# EAGLE design LED-driver (EAGLE 4.16)
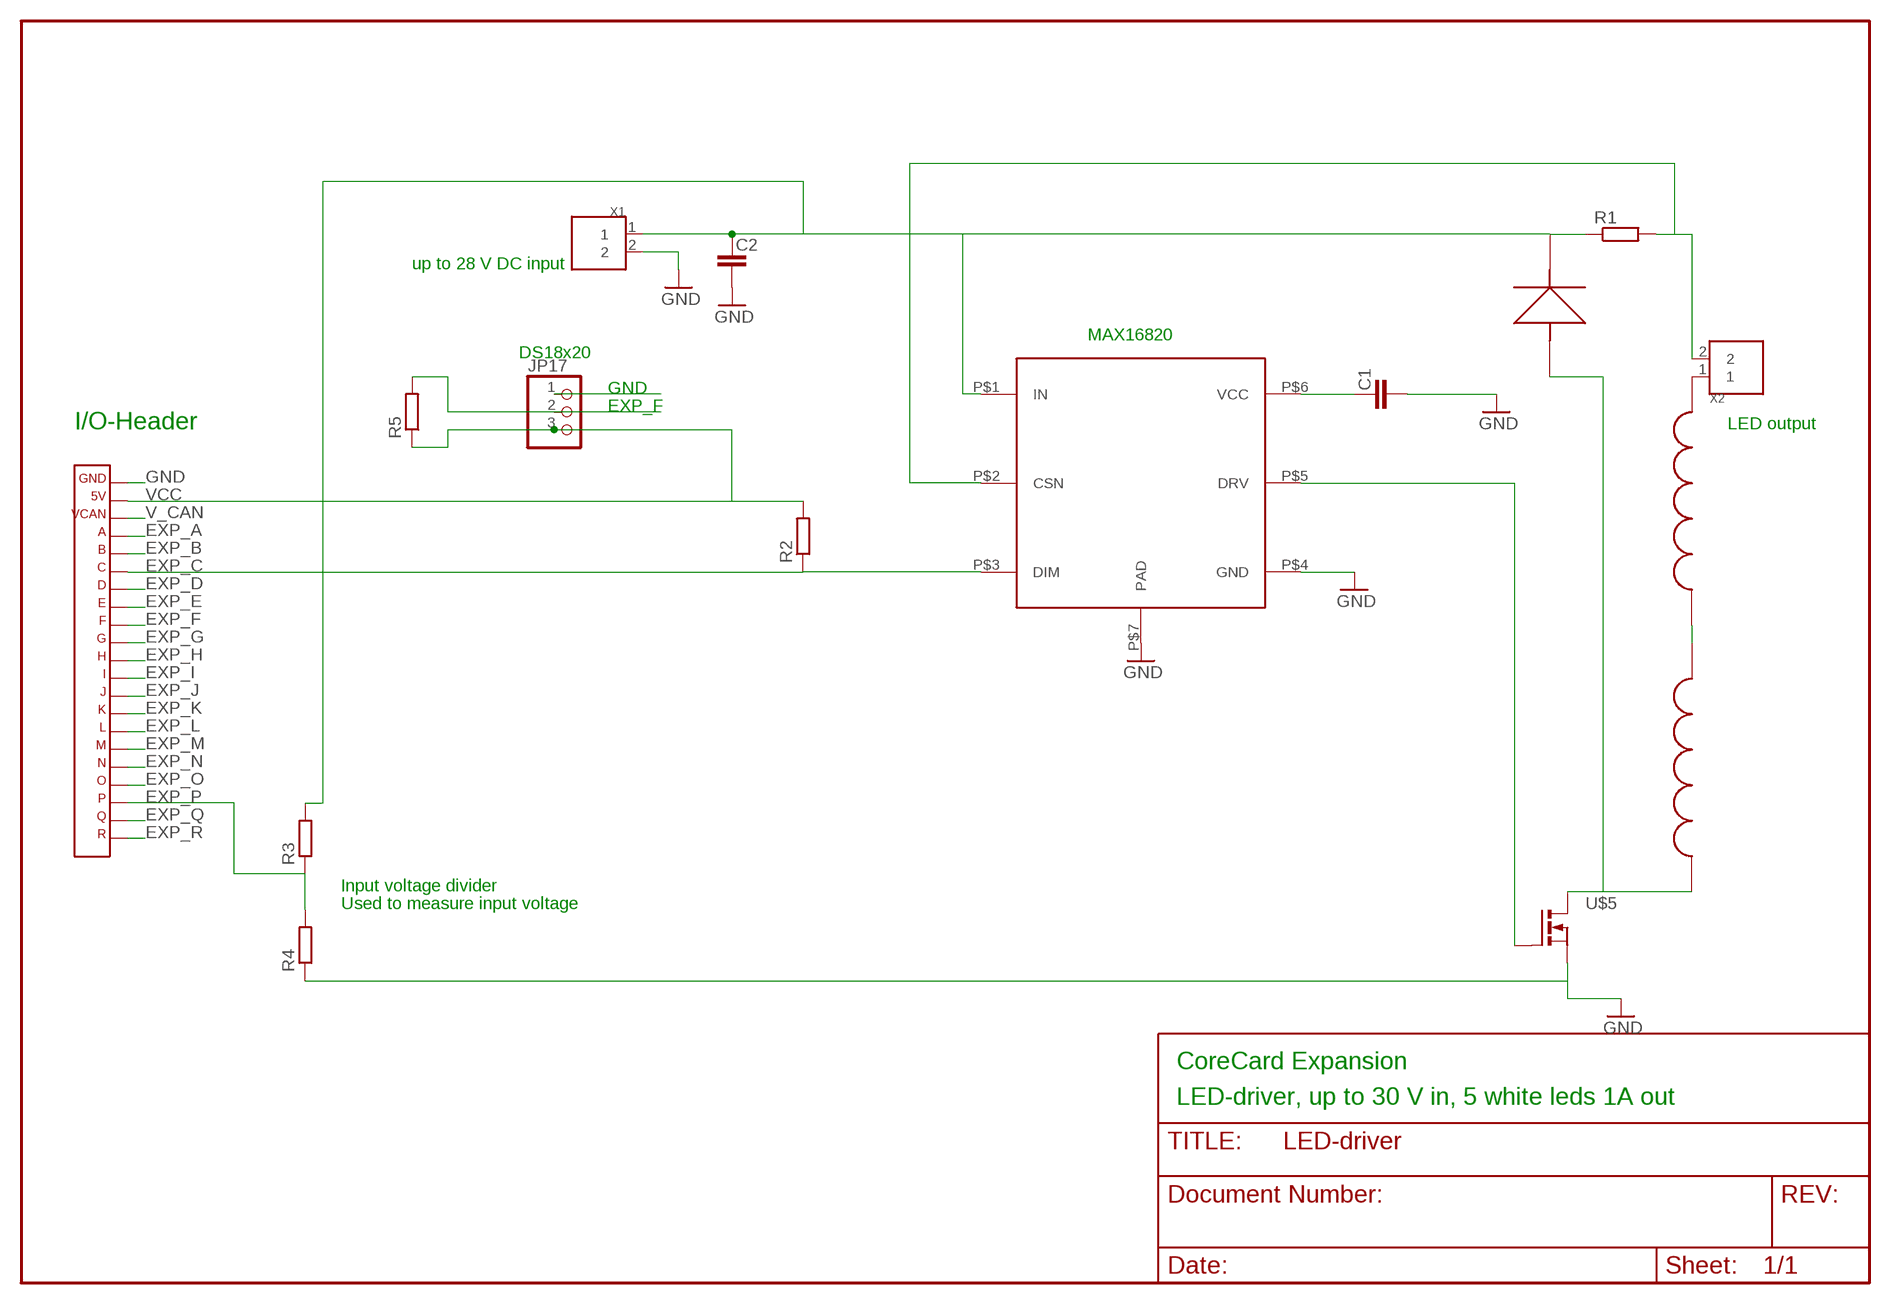
[diagram p0: schematic, sheet 1]

## Parts
C1  C-EUC0603  [C0603]
C2  C-EUC1210  [C1210]
JP17  PINHD-1X3  [1X03]
R1  R-EU_0207/10  [0207/10]
R2  R-EUR0603  [R0603@1]
R3  R-EUR0603  [R0603@1]
R4  R-EUR0603  [R0603@1]
R5  R-EUR0603  [R0603@1]
U$1  MAX16820  [TDFN-6]
U$2  HM77-SM2  [SM2]
U$3  HM77-SM2  [SM2]
U$4  10MQ040  [SMA]
U$5  N-FET-DPAK  [DPAK]
X1  BLOCK2  [PCB2]
X2  BLOCK2  [PCB2]
X3  CORE_IOHEADEXP  [CORE_IOHEAD_NOSILC]

## Nets
EXP_A: X3.4
EXP_B: X3.5
EXP_C: R2.1 U$1.P$3(DIM) X3.6
EXP_D: X3.7
EXP_E: X3.8
EXP_F: JP17.2 R5.2 X3.9
EXP_G: X3.10
EXP_H: X3.11
EXP_I: X3.12
EXP_J: X3.13
EXP_K: X3.14
EXP_L: X3.15
EXP_M: X3.16
EXP_N: X3.17
EXP_O: X3.18
EXP_P: R3.1 R4.2 X3.19
EXP_Q: X3.20
EXP_R: X3.21
GND: C1.2 C2.2 JP17.1 R4.1 U$1.P$4(GND) U$1.P$7(PAD) U$5.3 X1.2 X3.1
N$1: U$3.P$2 X2.1
N$2: U$2.P$2 U$3.P$1
N$3: U$2.P$1 U$4.P$2 U$5.4
N$4: C1.1 U$1.P$6(VCC)
N$5: C2.1 R1.1 R3.2 U$1.P$1(IN) U$4.P$1 X1.1
N$6: R1.2 U$1.P$2(CSN) X2.2
N$11: U$1.P$5(DRV) U$5.1
V_CAN: X3.3
VCC: JP17.3 R2.2 R5.1 X3.2

## Notes on the sheet
- up to 28 V DC input
- MAX16820
- DS18x20
- GND
- EXP_F
- I/O-Header | LED output
- Input voltage divider
- Used to measure input voltage
- CoreCard Expansion
- LED-driver, up to 30 V in, 5 white leds 1A out

## Library data of the parts
C1 C2 = rcl:C-EU
JP17 = pinhead:PINHD-1X3: PIN HEADER
R1 = rcl:R-EU_: RESISTOR, European symbol
R2-R5 = rcl:R-EU
U$1 = max168XX:MAX16820
U$2 U$3 = inductorHM77:HM77-SM2
U$4 = diode10MQ040sma:10MQ040
U$5 = transFET-DPAK:N-FET-DPAK
X1 X2 = terminal_block_5mm:BLOCK2
X3 = expboard:CORE_IOHEAD: CoreCard IO-header for expansion cards

## Board
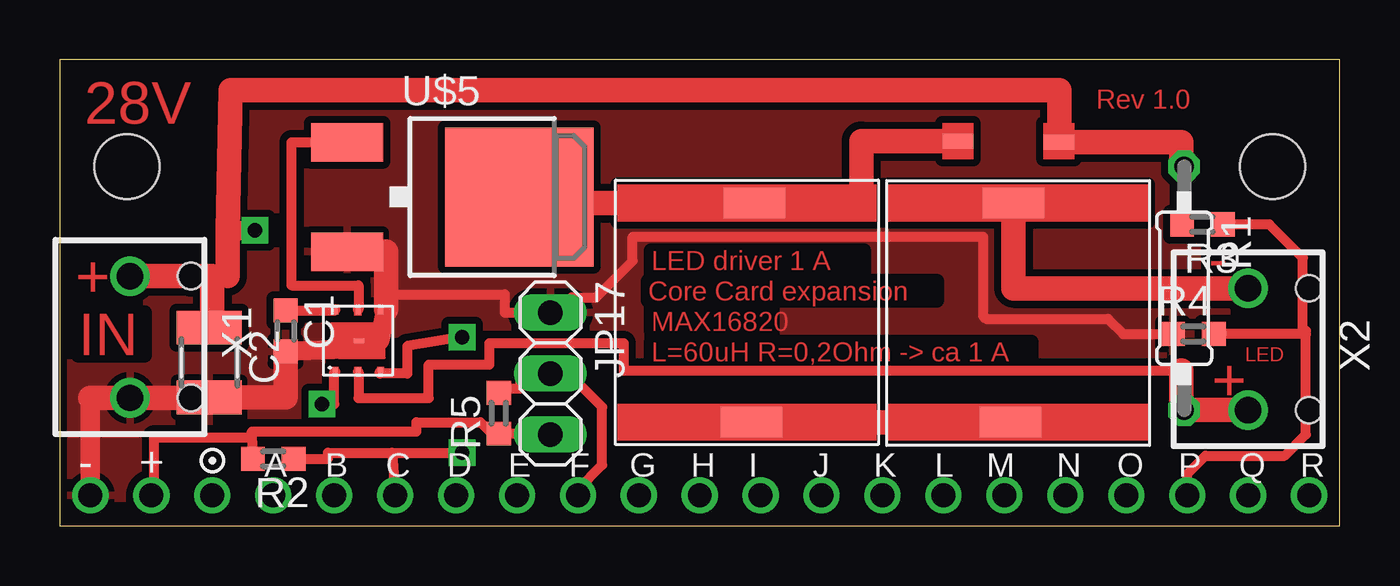
[diagram p1: board, top side]
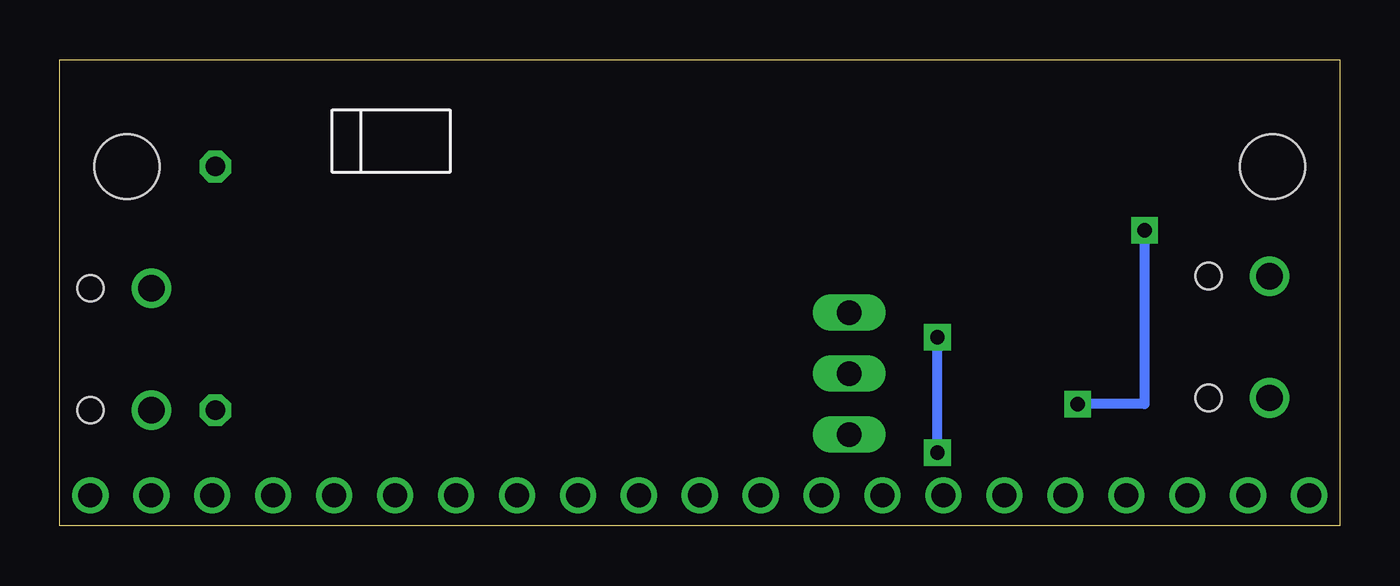
[diagram p2: board, bottom side, seen from below]

Size 53.34 x 19.43 mm. Coordinates in mm from the lower left corner, seen from the top.
Outline: 0,0 53.34,0 53.34,19.43 0,19.43 0,0
Copper layers (1*16): Top 0.035mm / dielectric 1.5mm / Bottom 0.035mm
Design rules "default": minimum track width 10mil, minimum drill 0.6mm, track to track 10mil, track to pad 10mil, pad to pad 10mil, via to via 10mil, smd to smd 8mil, copper to edge 10mil, drill to drill 8mil, minimum pad ring 10mil, minimum via ring 10mil, stop-mask expansion 4mil, vias tented up to drill 0mil, thermal gap 10mil
Holes 2.7 mm at 50.55,14.99 2.79,14.99

### Footprints (pad centres in the part's own frame; a part is rotated, then mirrored left to right if it is on the bottom)
C0603 = smd 1 x 1: 1 -0.85,0; 2 0.85,0
C1210 = smd 1.4 x 2.7: 1 -1.4,0; 2 1.5,0
1X03 = drill 1.016 long: 1 -2.54,0; 2 0,0; 3 2.54,0
0207/10 = drill 0.813 octagon: 1 -5.08,0; 2 5.08,0
R0603@1 = smd 0.991 x 1.016: 1 -0.85,0; 2 0.85,0
TDFN-6 = smd 0.203 x 0.406: P$1 0.55,0.2; P$2 1.5,0.2; P$3 2.45,0.2; P$4 2.45,2.8; P$5 1.5,2.8; P$6 0.55,2.8 | smd 0.406 x 0.203: P$7 1.55,1.5
SM2 = smd 1.27 x 2.54: P$1 1.016,5.842; P$2 10.16,5.715
SMA = smd 1.27 x 0.635: P$1 0.4,1.4; P$2 4.6,1.35
DPAK = smd 1.6 x 3: 1 1.53,1.55; 3 6.09,1.55 | smd 5.8 x 6.2: 4 3.81,8.73
PCB2 = drill 1.1 round: 1 -5.08,0; 2 0,0 | hole 1.1: -5.08,2.54; 0,2.54
CORE_IOHEAD_NOSILC = drill 1 round: 1 25.4,0; 2 22.86,0; 3 20.32,0; 4 17.78,0; 5 15.24,0; 6 12.7,0; 7 10.16,0; 8 7.62,0; 9 5.08,0; 10 2.54,0; 11 0,0; 12 -2.54,0; 13 -5.08,0; 14 -7.62,0; 15 -10.16,0; 16 -12.7,0; 17 -15.24,0; 18 -17.78,0; 19 -20.32,0; 20 -22.86,0; 21 -25.4,0

### Placement (x,y rotation side)
C1  9.4,8.13 270 top
C2  6.22,6.86 270 top
JP17  20.45,6.35 270 top
R1  46.86,9.91 270 top
R2  8.89,2.79 180 top
R3  47.62,12.57 180 top
R4  47.24,8 0 top
R5  18.29,4.7 90 top
U$1  10.92,6.22 0 top
U$2  23.11,14.48 270 top
U$3  45.47,3.3 90 top
U$4  42.04,17.4 180 top
U$5  10.41,17.53 270 top
X1  2.92,5.33 270 top
X2  49.53,4.83 270 top
X3  26.67,1.27 0 bottom

### Tracks (layer width: path | path; a pad name or v marks a point on that pad's centre or on a via)
EXP_C  (via drill 0.6)
  Top 0.406: R2.1 11.18,2.79 11.18,3.05 13.84,3.05 | 13.84,3.05 X3.6 | U$1.P$3 13.34,6.42 13.34,6.35 14.48,6.35 14.48,7.49 v16.76,7.87 | 13.84,3.05 v16.76,3.05
  Bottom 0.406: v16.76,3.05 v16.76,7.87
EXP_F
  Top 0.406: 18.41,5.55 18.41,5.46 | 18.41,5.55 R5.2 | 18.41,5.55 18.41,5.71 19.18,5.71 19.18,6.35 JP17.2 20.57,6.22 21.34,6.22 22.61,4.95 22.61,2.54 21.59,1.52 X3.9
EXP_P
  Top 0.406: R3.1 50.42,12.57 51.82,11.18 51.82,8.13 51.88,8.06 | 51.88,8.06 51.94,8 R4.2 48.01,8 | X3.19 46.99,2.16 47.75,2.92 51.05,2.92 51.94,3.81 51.94,8.13 51.88,8.06
GND
  Top 0.406: X1.2 3.05,5.33 | 6.22,5.33 C2.2 | C1.2 9.4,7.37 | 12.45,7.72 12.45,7.75 | 12.45,7.72 U$1.P$7 13.34,7.72 | 12.45,7.41 12.45,7.72 | 13.34,9.14 13.59,9.02 U$1.P$4 | 11.94,11.44 11.94,11.56 | 11.94,11.44 U$5.3 | 13.59,11.43 11.94,11.43 11.94,11.44 | 13.59,9.65 18.54,9.65 18.54,8.89 JP17.1 20.57,8.76 21.34,9.53 22.35,9.53 23.88,11.05 23.88,12.06 38.48,12.06 38.48,8.76 38.61,8.64 43.69,8.64 44.32,8 R4.1
  Top 0.813: X3.1 1.27,5.33 | C1.2 12.45,7.41 | 13.34,7.72 13.59,9.02
  Top 1.016: 1.27,5.33 X1.2 6.22,5.33 | C2.2 9.4,5.36 C1.2 | 13.59,9.02 13.59,9.65 13.59,11.43
  pour Top (isolate 0.305, rank 3): -0.13,19.43 53.34,19.43 53.34,17.78 50.04,17.78 arc90 47.62,15.49 47.62,14.48 arc90 50.04,12.06 53.34,12.06 53.34,1.14 0,1.14 0,12.06 3.3,12.06 arc90 5.71,14.48 5.71,15.49 arc90 3.43,17.78 -0.13,17.78
N$1
  Top 0.406: 35.18,13.46 U$3.P$2
  Top 1.016: X2.1 39.75,9.91 U$3.P$2
N$2
  Top 1.016: U$2.P$2 U$3.P$1
N$3
  Top 0.406: 28.83,13.46 U$2.P$1 | U$5.4 19.18,13.72 19.18,13.46
  Top 0.813: 33.4,13.59 28.96,13.59 U$2.P$1
  Top 1.016: 19.18,13.46 28.83,13.46 | U$4.P$2 33.4,16.05 33.4,13.59
N$4
  Top 0.406: U$1.P$6 11.43,9.02 11.43,8.98 C1.1
N$5  (via drill 0.6)
  Top 0.406: 6.35,8.26 C2.1 | U$1.P$1 11.43,6.42 11.43,5.08 v10.92,5.08 | R3.2 46.77,14.9 R1.1
  Top 0.813: 6.35,10.41 6.99,10.41 | 6.99,12.32 v8.13,12.32 | 41.66,16 U$4.P$1
  Top 1.016: X1.1 6.35,10.41 6.35,8.26 | 6.99,10.41 6.99,12.32 7.11,18.16 41.66,18.16 41.66,16 | R1.1 46.74,14.99 46.74,16 U$4.P$1
  Bottom 0.406: v10.92,5.08 8.13,5.08 v8.13,12.32
N$6
  Top 0.406: 46.86,4.95 R1.2 46.74,4.83 | 46.74,6.48 23.5,6.48 23.5,7.62 17.91,7.62 17.91,6.73 15.37,6.73 15.37,5.33 12.45,5.33 12.45,6.42 U$1.P$2
  Top 1.016: R1.2 X2.2 | 46.74,6.48 46.74,4.83
N$11
  Top 0.406: U$1.P$5 12.45,9.02 12.45,10.03 9.65,10.03 9.65,16 11.94,16 U$5.1
VCC
  Top 0.406: X3.2 3.94,1.27 3.94,3.68 8,3.68 8,3.81 | 8,3.81 R2.2 | JP17.3 20.41,3.85 R5.1 18,3.85 17.53,4.32 14.86,4.32 14.86,3.94 8,3.94 8,3.81

### Text on the board
Top: 28V | Rev 1.0 | LED driver 1 A | + | - | Core Card expansion | MAX16820 | IN | L=60uH R=0,2Ohm -> ca 1 A | LED | +
tPlace: - | + | A | B | C | D | E | F | G | H | I | J | K | L | M | N | O | P | Q | R
Document: Top is component side | Expansion will be mounted bottom to bottom with CoreCard | Change vertical dimension to fit | Remove mounting holes if neccesary | Remove I/O-header silcscreen if neccesary